# EasyEDA Pro project Sensor_colis_examples.epro, board 2024-06-03_06-27-10
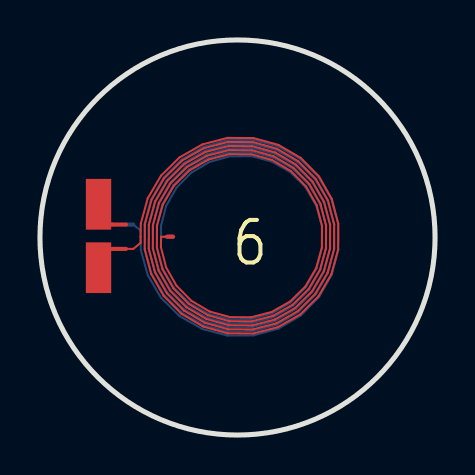
[diagram p10: board, top side]
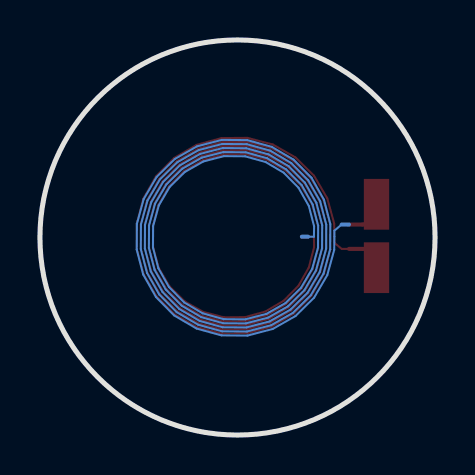
[diagram p11: board, bottom side, seen from below]

Outline 19.78 x 19.78 mm; copper layers: Top Layer, Bottom Layer. Coordinates in mm from the lower left corner of the outline.
Outline path: circle c9.89,9.89 r9.89
Stack: Top Layer 0.035mm - / Dielectric1 1.51mm FR4 er 4.5 / Bottom Layer 0.035mm -

## Design rules (mm)
template: 用户自定义配置
spacing safeClearance (default): track to track 0.152, other pairs 0.152 to 0.3
track width trackWidth (default): min 0.025, default 0.254, max 2.54
differential pair differentialPair (default): width min 0.127, default 0.254, max 2.54; gap min 0.152, default 0.152
via viaSize (default): diameter min 0.5, default 0.61, max 10; hole min 0.3, default 0.305, max 5.999

## Placement (name value [footprint] x y rotation side)
CSENSOR  -  [0402]  2.93 10.02 90 top

## Footprints (pads in the part's own frame, mm; a bottom-side part is the same pattern mirrored in y, then rotated)
0402
  rect 2.54x1.27 smd: 1(-1.639,0) 2(1.536,0)

## Nets
3: CSENSOR.1 CSENSOR.2

## Routing (per net, layer and track width the routed paths; a pad name or vN(x,y) marks a point on that pad's centre or on a via; arc(x,y) is an arc through that point)
3: length 289.9
  Top Layer w0.102: 4.31,9.32 4.67,9.32 5.04,9.63 5.04,9.93 5.05,10.59 5.4,11.85 6.06,12.98 6.99,13.9 8.13,14.55 9.39,14.88 10.69,14.87 11.94,14.53 13.06,13.87 13.97,12.95 14.61,11.82 14.94,10.58 14.93,9.29 14.59,8.05 13.94,6.94 13.03,6.04 11.91,5.41 10.68,5.08 9.4,5.09 8.18,5.43 7.08,6.07 6.19,6.98 5.56,8.08 5.24,9.3 5.25,10.56 5.59,11.78 6.22,12.86 7.12,13.74 8.2,14.36 9.41,14.68 10.66,14.67 11.86,14.34 12.94,13.71 13.81,12.82 14.42,11.75 14.73,10.55 14.73,9.31 14.4,8.12 13.78,7.06 12.9,6.2 11.84,5.59 10.65,5.29 9.43,5.3 8.25,5.62 7.2,6.23 6.35,7.1 5.75,8.15 5.45,9.33 5.46,10.53 5.78,11.7 6.38,12.73 7.24,13.58 8.28,14.17 9.44,14.47 10.64,14.46 11.79,14.15 12.81,13.55 13.65,12.7 14.23,11.67 14.53,10.52 14.52,9.34 14.21,8.2 13.61,7.19 12.78,6.36 11.76,5.78 10.62,5.49 9.46,5.5 8.33,5.81 7.33,6.4 6.51,7.22 5.94,8.23 5.65,9.35 5.66,10.51 5.96,11.62 6.55,12.61 7.37,13.42 8.36,13.98 9.47,14.27 10.61,14.26 11.71,13.96 12.69,13.38 13.48,12.57 14.04,11.59 14.33,10.5 14.32,9.37 14.02,8.28 13.45,7.31 12.65,6.53 11.68,5.97 10.6,5.69 9.48,5.7 8.41,6 7.45,6.56 6.68,7.35 6.13,8.31 5.85,9.38 5.86,10.48 6.15,11.54 6.71,12.49 7.49,13.25 8.44,13.79 9.5,14.07 10.58,14.06 11.63,13.77 12.56,13.22 13.32,12.45 13.85,11.51 14.12,10.47 14.12,9.39 13.83,8.36 13.29,7.44 12.53,6.69 11.6,6.16 10.57,5.9 9.51,5.9 8.49,6.19 7.58,6.72 6.84,7.47 6.32,8.39 6.06,9.41 6.06,9.93 6.37,9.93
  Top Layer w0.203: 4.31,9.32 2.94,9.32 ; 6.37,9.93 6.67,9.93 ; 2.94,10.72 2.94,10.63 3.62,10.54 4.31,10.54
  Bottom Layer w0.102: 6.37,9.93 6.06,9.93 6.06,10.45 6.32,11.47 6.84,12.39 7.58,13.14 8.49,13.67 9.51,13.96 10.57,13.97 11.6,13.7 12.53,13.17 13.29,12.42 13.83,11.5 14.12,10.47 14.12,9.39 13.85,8.35 13.32,7.41 12.56,6.64 11.63,6.09 10.58,5.8 9.5,5.79 8.44,6.07 7.49,6.61 6.71,7.38 6.15,8.32 5.86,9.38 5.85,10.48 6.13,11.55 6.68,12.51 7.45,13.3 8.41,13.86 9.48,14.16 10.6,14.17 11.68,13.89 12.65,13.34 13.45,12.55 14.02,11.58 14.32,10.49 14.33,9.37 14.04,8.27 13.48,7.29 12.69,6.48 11.71,5.9 10.61,5.6 9.47,5.59 8.36,5.88 7.37,6.44 6.55,7.25 5.96,8.24 5.66,9.35 5.65,10.51 5.94,11.63 6.51,12.64 7.33,13.46 8.33,14.05 9.46,14.36 10.62,14.37 11.76,14.08 12.78,13.5 13.61,12.67 14.21,11.66 14.52,10.52 14.53,9.34 14.23,8.19 13.65,7.16 12.81,6.32 11.79,5.71 10.64,5.4 9.44,5.39 8.28,5.69 7.24,6.28 6.38,7.13 5.78,8.16 5.46,9.33 5.45,10.53 5.75,11.71 6.35,12.76 7.2,13.63 8.25,14.24 9.43,14.57 10.65,14.57 11.84,14.27 12.9,13.66 13.78,12.8 14.4,11.74 14.73,10.55 14.73,9.31 14.42,8.12 13.81,7.04 12.94,6.15 11.86,5.52 10.66,5.19 9.41,5.19 8.2,5.5 7.12,6.12 6.22,7 5.59,8.09 5.25,9.3 5.24,10.56 5.56,11.78 6.19,12.89 7.08,13.79 8.18,14.43 9.4,14.77 10.68,14.78 11.91,14.45 13.03,13.82 13.94,12.92 14.59,11.81 14.93,10.57 14.94,9.29 14.61,8.04 13.97,6.91 13.06,5.99 11.94,5.33 10.69,4.99 9.39,4.98 8.13,5.31 6.99,5.96 6.06,6.88 5.4,8.01 5.05,9.27 5.04,9.93 5.04,10.23 4.67,10.54
  Bottom Layer w0.203: 4.67,10.54 4.31,10.54 ; 6.37,9.93 6.67,9.93

## Text on the board
Top Silkscreen Layer: Turns = 5 | Layers = 2 | Version - 1.1 | -------------- | Design Id - 108 | Coil Parameters | Customized for LDC1612 | Trace Width = 4.0 mils | Layer Stack Information | Trace Spacing = 4.0 mils | ------------------------- | WEBENCH Design Information | Copper thickness = 1.0 Oz-Cu | Exported on - 2024/06/03 06:27:08 | Inner Diameter = 314 mils (Approx.) | Outer Diameter = 394 mils (Approx.) | Space between TOP and BOTTOM = 4.0 mils | Exported from WEBENCH Coil Designer Tool | 6
